# Altium schematic sheet edp12.SchDoc
size A3; SheetNumber: 1; SheetTotal: 1
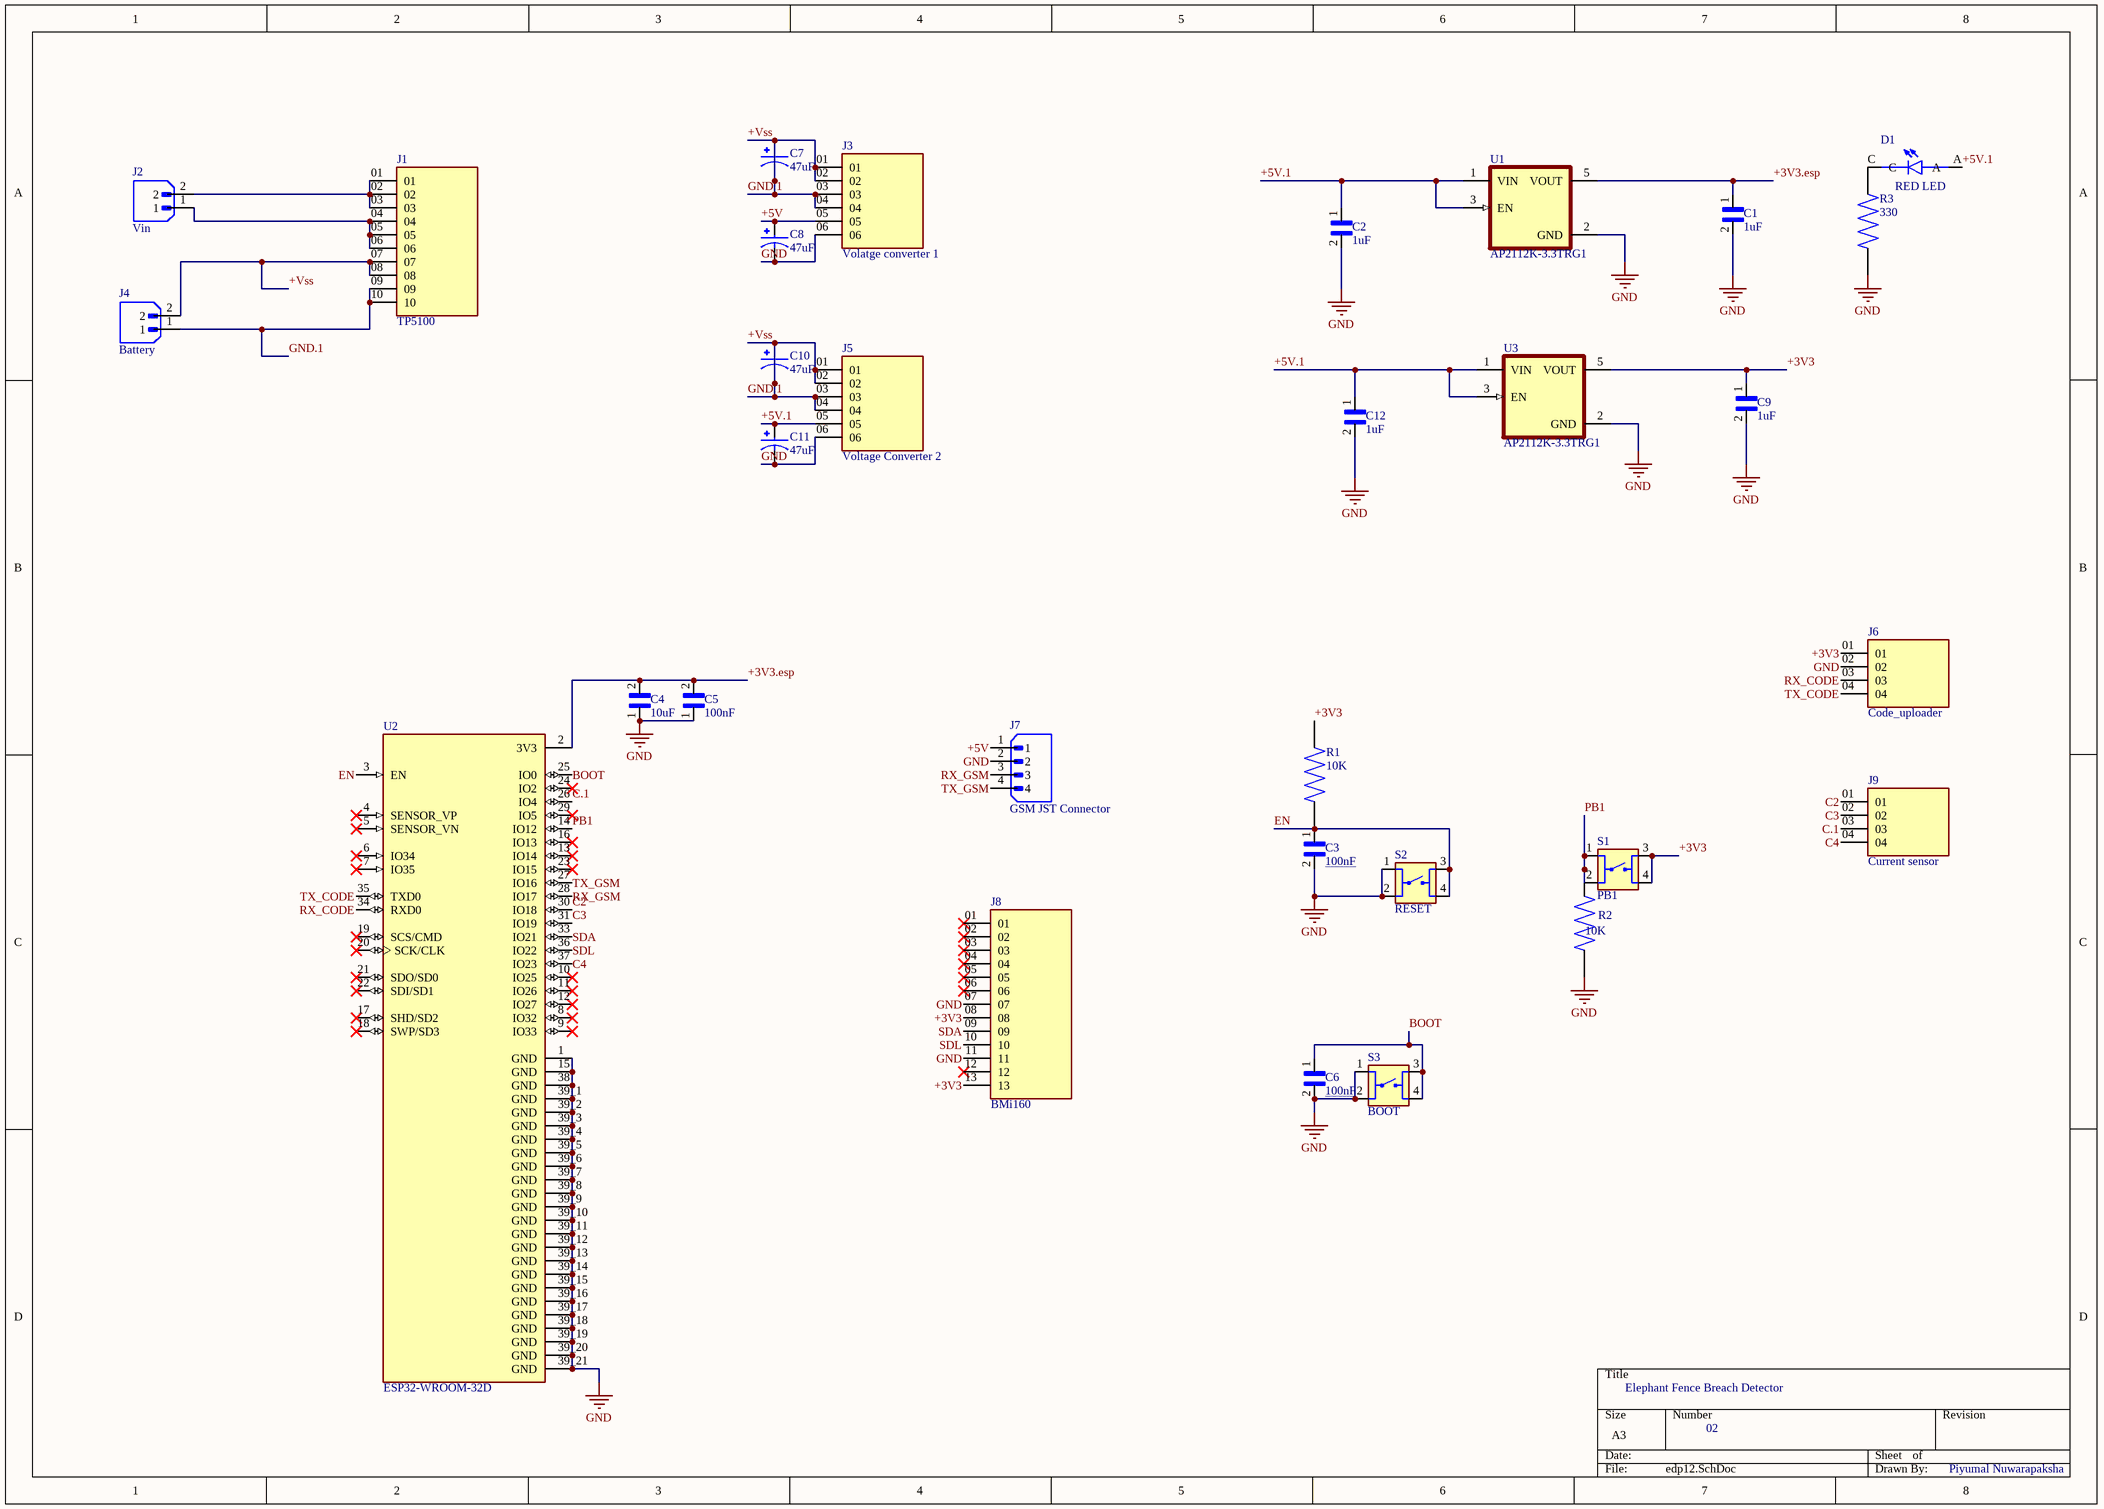
[diagram p0: edp12.SchDoc]

## Parts
C1  1uF  [CAPC2012X135N]
C2  1uF  [CAPC2012X135N]
C3  CL31A106KBHNNNE  [CAPC2012X135N]  (value not drawn)
C4  10uF  [CAPC2012X135N]
C5  100nF  [CAPC2012X135N]
C6  CL31A106KBHNNNE  [CAPC2012X135N]  (value not drawn)
C7  47uF  [CAP_EEEFH1V470XL]
C8  47uF  [CAP_EEEFH1V470XL]
C9  1uF  [CAPC2012X135N]
C10  47uF  [CAP_EEEFH1V470XL]
C11  47uF  [CAP_EEEFH1V470XL]
C12  1uF  [CAPC2012X135N]
D1  RED LED  [LEDC2012X70N]
J1  TP5100  [SAMTEC_TS-121-G-AA]
J2  Vin  [JST_B2B-XH-A(LF)(SN)]
J3  Volatge converter 1  [SAMTEC_TS-121-G-AA]
J4  Battery  [JST_B2B-XH-A(LF)(SN)]
J5  Voltage Converter 2  [SAMTEC_TS-121-G-AA]
J6  Code_uploader  [SAMTEC_TS-115-G-AA]
J7  GSM JST Connector  [JST_B4B-XH-A(LF)(SN)]
J8  BMi160  [SAMTEC_TS-115-G-AA]
J9  Current sensor  [SAMTEC_TS-115-G-AA]
R1  10K  [RESC2012X60N]
R2  10K  [RESC2012X60N]
R3  330  [RESC2012X60N]
S1  PB1  [SW_TS-1187A-B-A-B]
S2  RESET  [SW_TS-1187A-B-A-B]
S3  BOOT  [SW_TS-1187A-B-A-B]
U1  AP2112K-3.3TRG1  [SOT95P285X140-5N]
U2  ESP32-WROOM-32D  [MODULE_ESP32-WROOM-32D]
U3  AP2112K-3.3TRG1  [SOT95P285X140-5N]

## Nets
GND: C1.2 C2.2 C3.2 C4.1 C5.1 C6.2 C8.2 C9.2 C11.2 C12.2 J3.06 J5.06 J6.02 J7.2 J8.07 J8.11 R2.1 R3.1 S2.1 S2.2 S3.1 S3.2 U1.2(GND) U2.1(GND) U2.15(GND) U2.38(GND) U2.39_1(GND) U2.39_2(GND) U2.39_3(GND) U2.39_4(GND) U2.39_5(GND) U2.39_6(GND) U2.39_7(GND) U2.39_8(GND) U2.39_9(GND) U2.39_10(GND) U2.39_11(GND) U2.39_12(GND) U2.39_13(GND) U2.39_14(GND) U2.39_15(GND) U2.39_16(GND) U2.39_17(GND) U2.39_18(GND) U2.39_19(GND) U2.39_20(GND) U2.39_21(GND) U3.2(GND)
+3V3: C9.1 J6.01 J8.08 J8.13 R1.2 S1.3 S1.4 U3.5(VOUT)
+3V3.esp: C1.1 C4.2 C5.2 U1.5(VOUT) U2.2(3V3)
+5V: C8.1 J3.05 J7.1
+5V.1: C2.1 C11.1 C12.1 D1.A J5.05 U1.1(VIN) U1.3(EN) U3.1(VIN) U3.3(EN)
+Vss: C7.1 C7.2 C10.1 C10.2 J1.07 J1.08 J1.09 J1.10 J3.01 J3.02 J3.03 J3.04 J4.1 J4.2 J5.01 J5.02 J5.03 J5.04  [also labelled GND.1]
BOOT: C6.1 S3.3 S3.4 U2.25(IO0)
C2: J9.01 U2.30(IO18)
C3: J9.02 U2.31(IO19)
C4: J9.04 U2.37(IO23)
C.1: J9.03 U2.26(IO4)
EN: C3.1 R1.1 S2.3 S2.4 U2.3(EN)
PB1: R2.2 S1.1 S1.2 U2.14(IO12)
RX_CODE: J6.03 U2.34(RXD0)
RX_GSM: J7.3 U2.28(IO17)
SDA: J8.09 U2.33(IO21)
SDL: J8.10 U2.36(IO22)
TX_CODE: J6.04 U2.35(TXD0)
TX_GSM: J7.4 U2.27(IO16)
NetD1_C: D1.C R3.2
NetJ1_01: J1.01 J1.02 J1.03 J2.2
NetJ1_04: J1.04 J1.05 J1.06 J2.1

Not connected (* = marked no-connect by the designer): J8 01* 02* 03* 04* 05* 06* 12*; U2 4(SENSOR_VP)* 5(SENSOR_VN)* 6(IO34)* 7(IO35)* 8(IO32)* 9(IO33)* 10(IO25)* 11(IO26)* 12(IO27)* 13(IO14)* 16(IO13)* 17(SHD/SD2)* 18(SWP/SD3)* 19(SCS/CMD)* 20(SCK/CLK)* 21(SDO/SD0)* 22(SDI/SD1)* 23(IO15)* 24(IO2)* 29(IO5)*

## Notes on the sheet
- Elephant Fence Breach Detector
- 02
- Piyumal Nuwarapaksha
- (in symbol CL31A106KBHNNNE) 100nF

## Library data of the parts
C1 C2 C9 C12 = CL21B105KOFNNNE: Cap Ceramic 1uF 16V X7R 10% Pad SMD 0805 125C T/R; Package: None; Price: None; Value: *; MP: CL21B105KOFNNNE; Availability: Unavailable
C3 C6 = CL31A106KBHNNNE: 10ÂµF Â±10% 50V Ceramic Capacitor X5R 1206 (3216 Metric); MF: Samsung Electro-Mechanics; MP: CL31A106KBHNNNE; Value: *; Availability: Good; Package: 1206 Samsung; Price: None; SnapEDA_Link: https://www.snapeda.com/parts/CL31A106KBHNNNE/Samsung%20Electro-Mechanics/view-part/3597975/?ref=snap; Purchase-URL: https://pricing.snapeda.com/search/part/CL31A106KBHNNNE/?ref=eda
C4 C5 = CL21A106KAYNNNE: 10ÂµF Â±10% 25V Ceramic Capacitor X5R 0805 (2012 Metric); MF: Samsung; Value: *; Check_prices: https://www.snapeda.com/parts/CL21A106KAYNNNE/Samsung/view-part/3598482/?ref=eda; Package: 0805 Samsung; SnapEDA_Link: https://www.snapeda.com/parts/CL21A106KAYNNNE/Samsung/view-part/3598482/?ref=snap; MP: CL21A106KAYNNNE; Digi-Key_Part_Number: 1276-2891-1-ND
C7 C8 C10 C11 = EEEFH1V470XL: Aluminum Electrolytic Capacitors, FH-V[HF] (High temp. reflow) Series, 47uF +/- 20%, 35V, Surface mount type(6.3x7.7mm); MF: Panasonic; MP: EEE-FH1V470XL; SnapEDA_Link: https://www.snapeda.com/parts/EEE-FH1V470XL/Panasonic/view-part/?ref=snap; Package: RADIAL-2 Panasonic; Value: *; Check_prices: https://www.snapeda.com/parts/EEE-FH1V470XL/Panasonic/view-part/?ref=eda
D1 = 597-3305-607F: LED Uni-Color Green 4-Pin Chip 0805 T/R; Availability: Unavailable; Value: *; Price: None; MP: 597-3305-607F; Package: None
J1 J3 J5 = TS-121-G-AA: Connector Header position; MF: Samtec; Availability: In Stock; Purchase-URL: https://pricing.snapeda.com/search/part/TS-121-G-AA/?ref=eda; Check_prices: https://www.snapeda.com/parts/TS-121-G-AA/Samtec/view-part/?ref=eda; MP: TS-121-G-AA; Price: None; Value: *; SnapEDA_Link: https://www.snapeda.com/parts/TS-121-G-AA/Samtec/view-part/?ref=snap; Package: None
J2 J4 = B2B-XH-A(LF)(SN): Connector Header Through Hole 2 position 0.098 (2.50mm); MF: JST Sales; SnapEDA_Link: https://www.snapeda.com/parts/B2B-XH-A(LF)(SN)/JST/view-part/?ref=snap; Package: None; Value: *; MP: B2B-XH-A(LF)(SN); Check_prices: https://www.snapeda.com/parts/B2B-XH-A(LF)(SN)/JST/view-part/?ref=eda
J6 J8 J9 = TS-115-G-AA: MF: Samtec; Value: *; MP: TS-115-G-AA; Availability: Unavailable; Package: None; Price: None
J7 = B4B-XH-A(LF)(SN): Connector Header Through Hole 4 position 0.098 (2.50mm); MF: JST Sales; SnapEDA_Link: https://www.snapeda.com/parts/B4B-XH-A(LF)(SN)/JST+Sales+America+Inc./view-part/?ref=snap; Package: None; Value: *; MP: B4B-XH-A(LF)(SN); Check_prices: https://www.snapeda.com/parts/B4B-XH-A(LF)(SN)/JST+Sales+America+Inc./view-part/?ref=eda
R1-R3 = RC0805FR-0710KL: 10 kOhms Â±1% 0.125W, 1/8W Chip Resistor 0805 (2012 Metric) Moisture Resistant Thick Film; MF: Yageo; Value: *; SnapEDA_Link: https://www.snapeda.com/parts/RC0805FR-0710KL/Yageo/view-part/?ref=snap; Purchase-URL: https://pricing.snapeda.com/search/part/RC0805FR-0710KL/?ref=eda; Availability: In Stock; Price: None; Package: 2012 Rohm Semiconductor; Check_prices: https://www.snapeda.com/parts/RC0805FR-0710KL/Yageo/view-part/?ref=eda; MP: RC0805FR-0710KL
S1-S3 = FSM8JH: Tactile Switch SPST-NO Top Actuated Through Hole; MF: TE Connectivity; Check_prices: https://www.snapeda.com/parts/FSM8JH/TE+Connectivity+ALCOSWITCH+Switches/view-part/?ref=eda; Value: *; Availability: In Stock; MP: FSM8JH; Price: None; Package: None; SnapEDA_Link: https://www.snapeda.com/parts/FSM8JH/TE+Connectivity+ALCOSWITCH+Switches/view-part/?ref=snap
U1 U3 = AP2112K-3.3TRG1: Linear Voltage Regulator IC Positive Fixed 1 Output 600mA SOT-25; MF: Diodes Inc.; Value: *; Purchase-URL: https://pricing.snapeda.com/search/part/AP2112K-3.3TRG1/?ref=eda; Package: SOT-753 Diodes Inc.; Availability: In Stock; Check_prices: https://www.snapeda.com/parts/AP2112K-3.3TRG1/Diodes+Inc./view-part/?ref=eda; Price: None; SnapEDA_Link: https://www.snapeda.com/parts/AP2112K-3.3TRG1/Diodes+Inc./view-part/?ref=snap; MP: AP2112K-3.3TRG1
U2 = ESP32-WROOM-32D: Bluetooth, WiFi 802.11b/g/n, Bluetooth v4.2 +EDR, Class 1, 2 and 3 Transceiver Module 2.4GHz ~ 2.5GHz Integrated; MF: Espressif Systems; SnapEDA_Link: https://www.snapeda.com/parts/ESP32-WROOM-32D/Espressif+Systems/view-part/?ref=snap; Package: Non Standard Espressif Systems; Value: *; MP: ESP32-WROOM-32D; Check_prices: https://www.snapeda.com/parts/ESP32-WROOM-32D/Espressif+Systems/view-part/?ref=eda